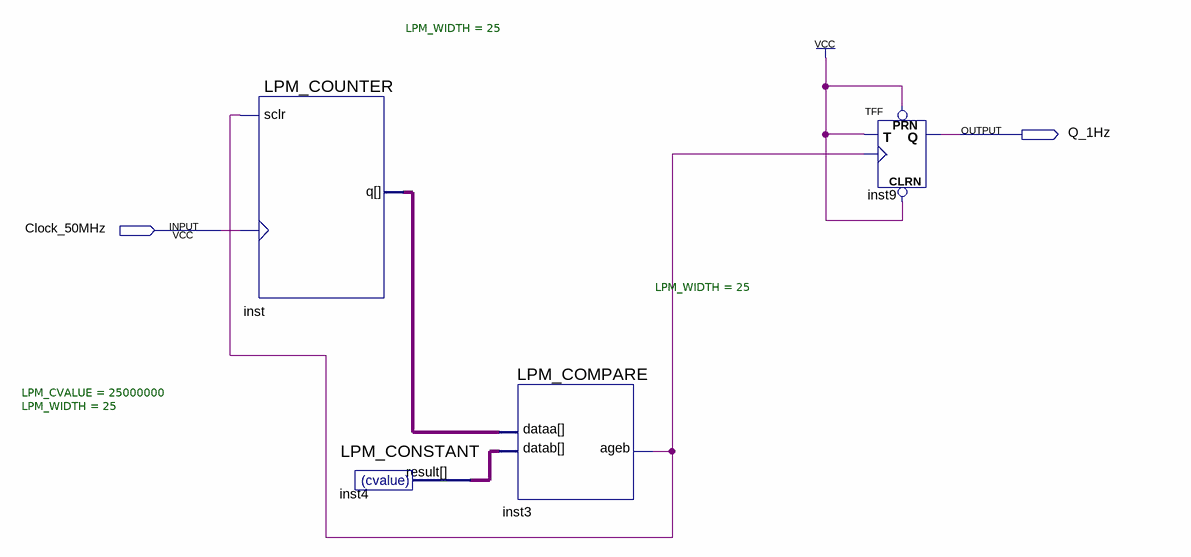
[diagram p0: schematic sheet]
// Quartus schematic DIV_50MHz_to_1Hz.bdf as structural Verilog: 4 symbols, 2 pins
module DIV_50MHz_to_1Hz (
  input  Clock_50MHz,
  output Q_1Hz
);

  wire inst3_ageb;
  wire [24:0] inst4_result, inst_q;

  LPM_COUNTER #(.LPM_WIDTH(25)) inst (.clock(Clock_50MHz), .sclr(inst3_ageb), .q(inst_q));
  LPM_CONSTANT #(.LPM_CVALUE(25000000), .LPM_WIDTH(25)) inst4 (.result(inst4_result));
  LPM_COMPARE #(.LPM_WIDTH(25)) inst3 (.dataa(inst_q), .datab(inst4_result), .ageb(inst3_ageb));
  TFF inst9 (.PRN(1'b1), .CLRN(1'b1), .T(1'b1), .CLK(inst3_ageb), .Q(Q_1Hz));
endmodule
